# Altium schematic sheet rp2350a.SchDoc
size A; SheetNumber: 1; SheetTotal: 3
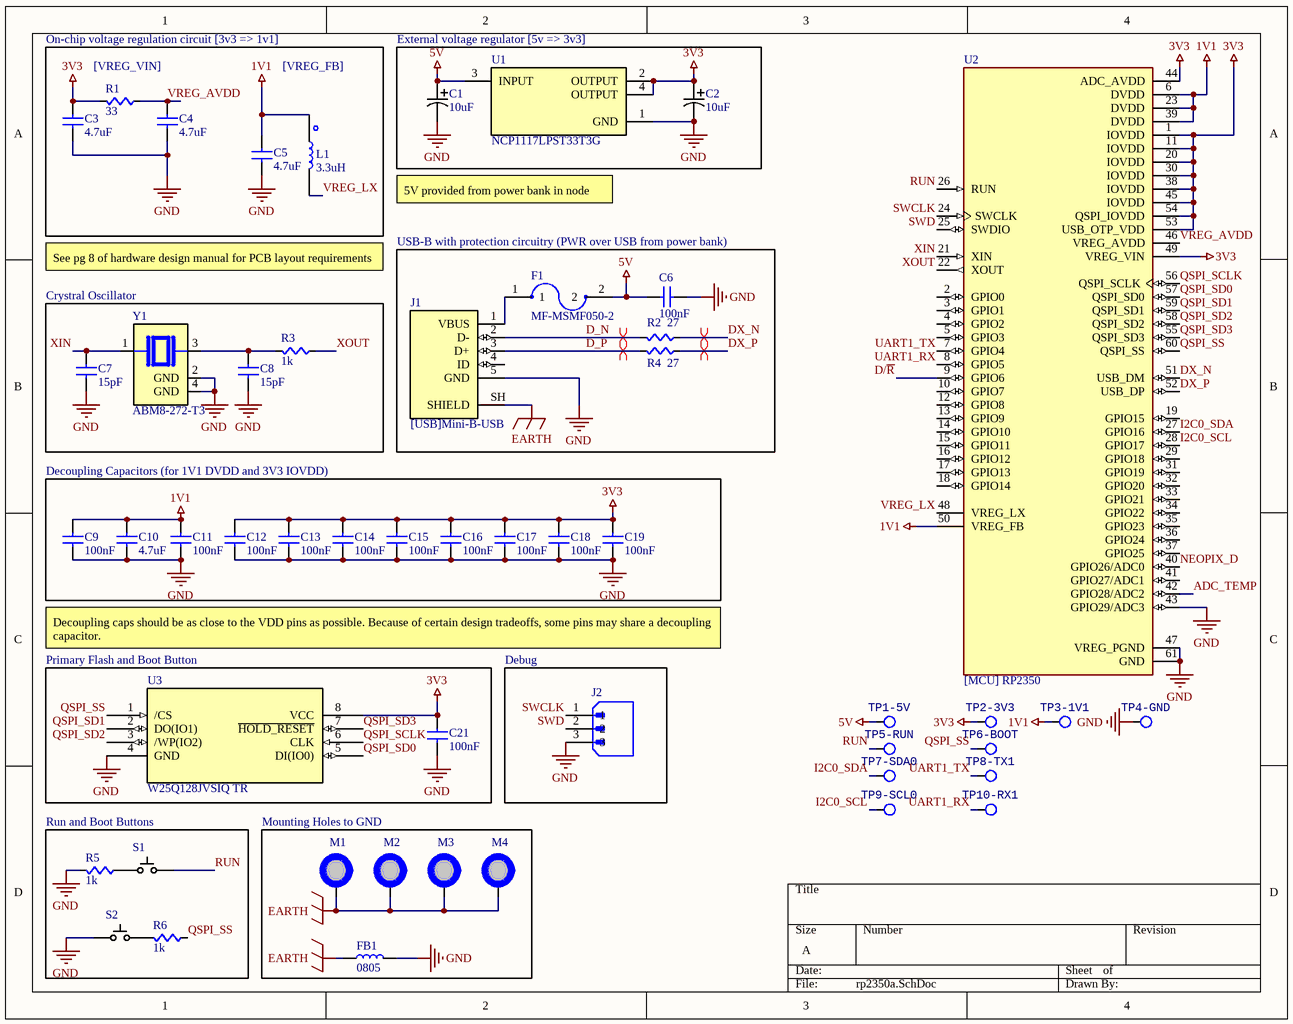
[diagram p0: rp2350a.SchDoc]

## Parts
C1  10uF  [RADIAL_CAN_CAP_4_X_5.8_SMD]
C2  10uF  [RADIAL_CAN_CAP_4_X_5.8_SMD]
C3  value 4.7uF  [CAPC0603]  (hidden comment: Cap)
C4  value 4.7uF  [CAPC0603]  (hidden comment: Cap)
C5  value 4.7uF  [CAPC0603]  (hidden comment: Cap)
C6  value 100nF  [CAPC0603]  (hidden comment: Cap)
C7  value 15pF  [CAPC0603]  (hidden comment: Cap)
C8  value 15pF  [CAPC0603]  (hidden comment: Cap)
C9  value 100nF  [CAPC0603]  (hidden comment: Cap)
C10  value 4.7uF  [CAPC0603]  (hidden comment: Cap)
C11  value 100nF  [CAPC0603]  (hidden comment: Cap)
C12  value 100nF  [CAPC0603]  (hidden comment: Cap)
C13  value 100nF  [CAPC0603]  (hidden comment: Cap)
C14  value 100nF  [CAPC0603]  (hidden comment: Cap)
C15  value 100nF  [CAPC0603]  (hidden comment: Cap)
C16  value 100nF  [CAPC0603]  (hidden comment: Cap)
C17  value 100nF  [CAPC0603]  (hidden comment: Cap)
C18  value 100nF  [CAPC0603]  (hidden comment: Cap)
C19  value 100nF  [CAPC0603]  (hidden comment: Cap)
C21  value 100nF  [CAPC0603]  (hidden comment: Cap)
F1  MF-MSMF050-2  [FUSM4632X85]
FB1  0805  [L0805]
J1  [USB]Mini-B-USB  [SAMTEC_MUSB-05-X-B-SM-A-R-K-TR]
J2  [Connector] 1x3-header-2.54mm pitch  [1x3-2.54MM-MALE-HEADER]  (value not drawn)
L1  3.3uH  [2016_SMD_Inductor]
M1  M3 Mount Hole  [3.5MM-MOUNTING-HOLE]  (value not drawn)  (no BOM)
M2  M3 Mount Hole  [3.5MM-MOUNTING-HOLE]  (value not drawn)  (no BOM)
M3  M3 Mount Hole  [3.5MM-MOUNTING-HOLE]  (value not drawn)  (no BOM)
M4  M3 Mount Hole  [3.5MM-MOUNTING-HOLE]  (value not drawn)  (no BOM)
R1  value 33  [RES0603]  (hidden comment: Res)
R2  value 27  [RES0603]  (hidden comment: Res)
R3  value 1k  [RES0603]  (hidden comment: Res)
R4  value 27  [RES0603]  (hidden comment: Res)
R5  value 1k  [RES0603]  (hidden comment: Res)
R6  value 1k  [RES0603]  (hidden comment: Res)
S1  [SPST] SMD Pushbutton  [[SPST] SMD Pushbutton]  (value not drawn)
S2  [SPST] SMD Pushbutton  [[SPST] SMD Pushbutton]  (value not drawn)
TP1-5V  TP  [TPTH-100mil]  (value not drawn)  (no BOM)
TP2-3V3  TP  [TPTH-100mil]  (value not drawn)  (no BOM)
TP3-1V1  TP  [TPTH-100mil]  (value not drawn)  (no BOM)
TP4-GND  TP  [TPTH-100mil]  (value not drawn)  (no BOM)
TP5-RUN  TP  [TPTH-100mil]  (value not drawn)  (no BOM)
TP6-BOOT  TP  [TPTH-100mil]  (value not drawn)  (no BOM)
TP7-SDA0  TP  [TPTH-100mil]  (value not drawn)  (no BOM)
TP8-TX1  TP  [TPTH-100mil]  (value not drawn)  (no BOM)
TP9-SCL0  TP  [TPTH-100mil]  (value not drawn)  (no BOM)
TP10-RX1  TP  [TPTH-100mil]  (value not drawn)  (no BOM)
U1  NCP1117LPST33T3G  [SOT230P700X175-4N]
U2  [MCU] RP2350  [QFN40P700X700X90-61N]
U3  W25Q128JVSIQ TR  [SOIC-8-W-208MIL-2]
Y1  ABM8-272-T3  [XTAL_ABM8-272-T3]

## Blocks framed on the sheet
External voltage regulator [5v => 3v3]: C1 C2 U1
Crystral Oscillator: C7 C8 R3 Y1
Decoupling Capacitors (for 1V1 DVDD and 3V3 IOVDD): C9-C19
Primary Flash and Boot Button: C21 U3
Debug: J2
Run and Boot Buttons: R5 R6 S1 S2
Mounting Holes to GND: FB1 M1-M4

## Nets
1V1: C5.1(A) C9.1(A) C10.1(A) C11.1(A) L1.1 TP3-1V1.1 U2.6(DVDD) U2.23(DVDD) U2.39(DVDD) U2.50(VREG_FB)
3V3: C2.1 C3.1(A) C12.1(A) C13.1(A) C14.1(A) C15.1(A) C16.1(A) C17.1(A) C18.1(A) C19.1(A) C21.1(A) R1.1(A) TP2-3V3.1 U1.2(OUTPUT) U1.4(OUTPUT) U2.1(IOVDD) U2.11(IOVDD) U2.20(IOVDD) U2.30(IOVDD) U2.38(IOVDD) U2.44(ADC_AVDD) U2.45(IOVDD) U2.49(VREG_VIN) U2.53(USB_OTP_VDD) U2.54(QSPI_IOVDD) U3.8(VCC)
5V: C1.1 C6.2(B) F1.2 TP1-5V.1 U1.3(INPUT)
EARTH: FB1.1 J1.SH(SHIELD) M1.1 M2.1 M3.1 M4.1
GND: C1.2 C2.2 C3.2(B) C4.2(B) C5.2(B) C6.1(A) C7.2(B) C8.2(B) C9.2(B) C10.2(B) C11.2(B) C12.2(B) C13.2(B) C14.2(B) C15.2(B) C16.2(B) C17.2(B) C18.2(B) C19.2(B) C21.2(B) FB1.2 J1.5(GND) J2.3 R5.1(A) S2.1 TP4-GND.1 U1.1(GND) U2.43(GPIO29/ADC3) U2.47(VREG_PGND) U2.61(GND) U3.4(GND) Y1.2(GND) Y1.4(GND)
ADC_TEMP: U2.42(GPIO28/ADC2)
D/~{R}: U2.9(GPIO6)
D_N: J1.2(D-) R2.1(A)
D_P: J1.3(D+) R4.1(A)
DX_N: R2.2(B) U2.51(USB_DM)
DX_P: R4.2(B) U2.52(USB_DP)
I2C0_SCL: TP9-SCL0.1 U2.28(GPIO17)
I2C0_SDA: TP7-SDA0.1 U2.27(GPIO16)
NEOPIX_D: U2.40(GPIO26/ADC0)
QSPI_SCLK: U2.56(QSPI_SCLK) U3.6(CLK)
QSPI_SD0: U2.57(QSPI_SD0) U3.5(DI(IO0))
QSPI_SD1: U2.59(QSPI_SD1) U3.2(DO(IO1))
QSPI_SD2: U2.58(QSPI_SD2) U3.3(/WP(IO2))
QSPI_SD3: U2.55(QSPI_SD3) U3.7(~{HOLD_RESET})
QSPI_SS: R6.2(B) TP6-BOOT.1 U2.60(QSPI_SS) U3.1(/CS)
RUN: S1.2 TP5-RUN.1 U2.26(RUN)
SWCLK: J2.1 U2.24(SWCLK)
SWD: J2.2 U2.25(SWDIO)
UART1_RX: TP10-RX1.1 U2.8(GPIO5)
UART1_TX: TP8-TX1.1 U2.7(GPIO4)
VREG_AVDD: C4.1(A) R1.2(B) U2.46(VREG_AVDD)
VREG_LX: L1.2 U2.48(VREG_LX)
XIN: C7.1(A) U2.21(XIN) Y1.1
XOUT: R3.2(B) U2.22(XOUT)
NetC8_1: C8.1(A) R3.1(A) Y1.3
NetF1_1: F1.1 J1.1(VBUS)
NetR5_2: R5.2(B) S1.1
NetR6_1: R6.1(A) S2.2

Not connected (* = marked no-connect by the designer): J1 4(ID); U2 2(GPIO0) 3(GPIO1) 4(GPIO2) 5(GPIO3) 10(GPIO7) 12(GPIO8) 13(GPIO9) 14(GPIO10) 15(GPIO11) 16(GPIO12) 17(GPIO13) 18(GPIO14) 19(GPIO15) 29(GPIO18) 31(GPIO19) 32(GPIO20) 33(GPIO21) 34(GPIO22) 35(GPIO23) 36(GPIO24) 37(GPIO25) 41(GPIO27/ADC1)

## Layout directives
differential pair: D_N, D_P, DX_N, DX_P

## Notes on the sheet
- On-chip voltage regulation circuit [3v3 => 1v1]
- [VREG_VIN]
- [VREG_FB]
- 5V provided from power bank in node
- See pg 8 of hardware design manual for PCB layout requirements
- USB-B with protection circuitry (PWR over USB from power bank)
- Decoupling caps should be as close to the VDD pins as possible. Because of certain design tradeoffs, some pins may share a decoupling capacitor.

## Library data of the parts
C1 C2 = EEE-FK1E100R: 10uF electrolytic cap, radial can, SMD; Manufacturer_Name: Panasonic; Copyright: Copyright (C) 2025 Ultra Librarian. All rights reserved.; Manufacturer_Part_Number: EEE-FK1E100R
F1 = MF-MSMF050-2: [Fuse] Polymeric PTC Resettable Fuse 15V 500 mA Ih Surface Mount 1812 (4532 Metric), Concave; MF: Bourns; MP: MF-MSMF050-2; Availability: In Stock; Check_prices: https://www.snapeda.com/parts/MF-MSMF050-2/Bourns+-+J.W.+Miller/view-part/?ref=eda; Price: None; Package: 1812 Bourns; Purchase-URL: https://pricing.snapeda.com/search/part/MF-MSMF050-2/?ref=eda; Value: *; SnapEDA_Link: https://www.snapeda.com/parts/MF-MSMF050-2/Bourns+-+J.W.+Miller/view-part/?ref=snap
FB1 = MH2029-300Y: [Inductor] Ferrite Bead Bourns MH2029-300Y / SMD-FERRITE-BEAD-30R-3A(0805); SnapEDA_Link: https://www.snapeda.com/parts/MH2029-300Y/Bourns/view-part/?ref=snap; Package: 0805 Bourns; Value: *; MF: Bourns; MP: MH2029-300Y; Check_prices: https://www.snapeda.com/parts/MH2029-300Y/Bourns/view-part/?ref=eda
J1 = [USB]Mini-B-USB: USB - mini B USB 2.0 Receptacle Connector 5 Position Surface Mount, Right Angle / MUSB-05-X-B-SM-A-R-K-TR; MF: Samtec; MP: MUSB-05-F-B-SM-A-R-K-TR; SnapEDA_Link: https://www.snapeda.com/parts/MUSB-05-F-B-SM-A-R-K-TR/Samtec/view-part/?ref=snap; Package: None; Value: *; Check_prices: https://www.snapeda.com/parts/MUSB-05-F-B-SM-A-R-K-TR/Samtec/view-part/?ref=eda
J2 = [Connector] 1x3-header-2.54mm pitch: 1x3 2.54mm header; MP: G800W305018EU; MF: FCI Connectors; Availability: In Stock; Value: *; SnapEDA_Link: https://www.snapeda.com/parts/G800W305018EU/NEC/view-part/?ref=snap; Price: None; Check_prices: https://www.snapeda.com/parts/G800W305018EU/NEC/view-part/?ref=eda; Package: None
L1 = INDUCTOR 3.3uH: Power Inductors - SMD IND 3.3uH used for RP2350 VREG; Manufacturer_Name: ABRACON; Manufacturer_Part_Number: AOTA-B201610S3R3-101-T; Geometry.Height: 1mm; Mouser Part Number: 815-AB201610S3R3101T; Mouser Price/Stock: https://www.mouser.co.uk/ProductDetail/ABRACON/AOTA-B201610S3R3-101-T?qs=%252BXxaIXUDbq0IZvJW%2F2mv4w%3D%3D; Datasheet Link: https://abracon.com/datasheets/AOTA-B201610S3R3-101-T.pdf
M1-M4 = [Mount] M3 Mount Hole: Place at least 4.5mm from board edge. Plated.
R1-R6 = Res: SMD, RES0603; Supplier 1: Digi-Key; Supplier Part Number 1: RMCF0603JT10K0CT-ND
S1 S2 = [SPST] SMD Pushbutton: PTS815SJM250SMTRLFS; Supplier 1: DigiKey; Supplier Part Number 1: CKN12215-6-ND
TP1-5V TP2-3V3 TP3-1V1 TP4-GND TP5-RUN TP6-BOOT TP7-SDA0 TP8-TX1 TP9-SCL0 TP10-RX1 = TP: Test Point
U1 = NCP1117LPST33T3G: Linear Voltage Regulator IC Positive Fixed 1 Output 1A SOT-223; MF: ON Semiconductor; SnapEDA_Link: https://www.snapeda.com/parts/NCP1117LPST33T3G/Onsemi/view-part/?ref=snap; Package: SOT-223-4 ON Semiconductor; Value: *; MP: NCP1117LPST33T3G; Check_prices: https://www.snapeda.com/parts/NCP1117LPST33T3G/Onsemi/view-part/?ref=eda
U2 = SC1509(13): RP2350A MCU from Raspberry Pi Pico; QFN 60 7x7,; MP: SC1509-A4; SnapEDA_Link: https://www.snapeda.com/parts/SC1509-A4/Raspberry+Pi/view-part/?ref=snap; Package: None; Value: *; MF: Raspberry Pi; Check_prices: https://www.snapeda.com/parts/SC1509-A4/Raspberry+Pi/view-part/?ref=eda
U3 = W25Q128JVSIQ TR: IC FLASH 128MBIT SPI/QUAD 8SOIC; Manufacturer_Name: Winbond; Copyright: Copyright (C) 2025 Ultra Librarian. All rights reserved.; Manufacturer_Part_Number: W25Q128JVSIQ TR; RefDes: RefDes; Type: Type
Y1 = ABM8-272-T3: 12 MHz Â±30ppm Crystal 10pF 50 Ohms 4-SMD, No Lead; MF: ABRACON; SnapEDA_Link: https://www.snapeda.com/parts/ABM8-272-T3/Abracon/view-part/?ref=snap; Package: NON-STANDARD-4 Abracon; Value: *; MP: ABM8-272-T3; Check_prices: https://www.snapeda.com/parts/ABM8-272-T3/Abracon/view-part/?ref=eda
C3-C19 C21 = Cap: Supplier 1: Digi-Key; Supplier Part Number 1: 1276-1000-1-ND